# Altium schematic sheet Sheet1.SchDoc
size A4
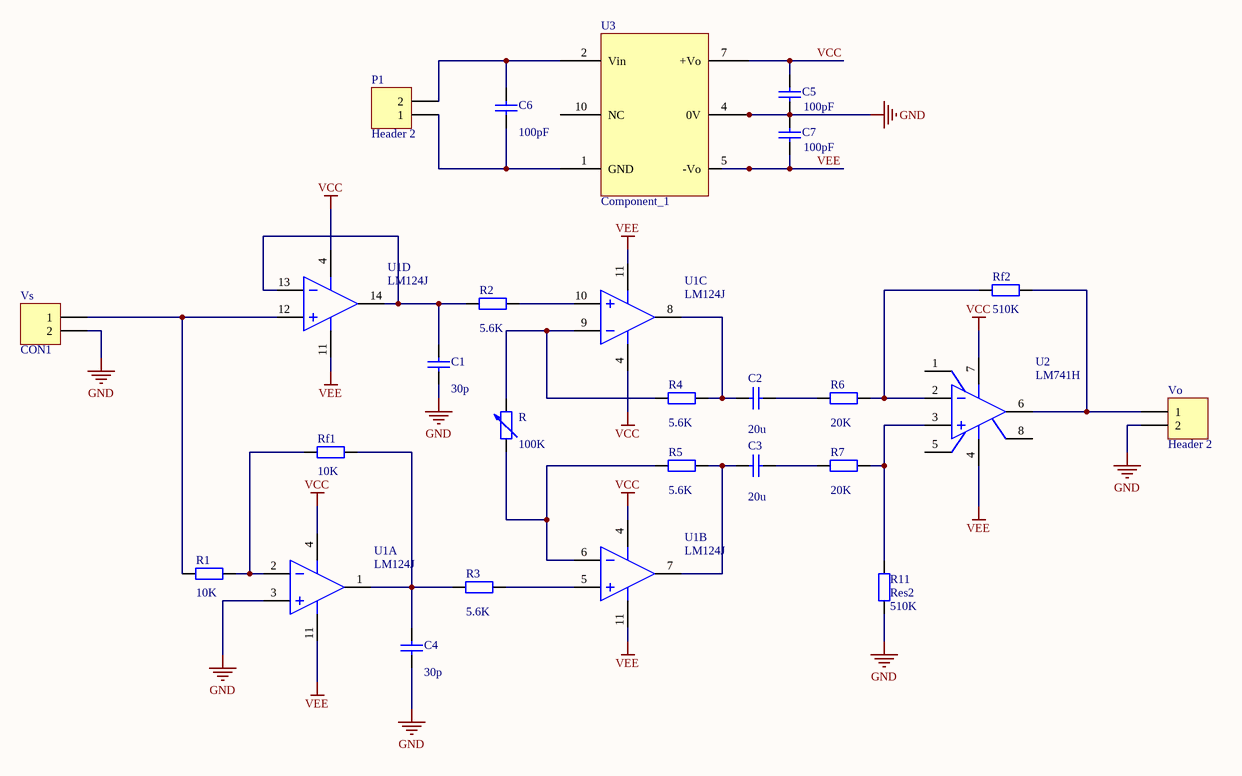
[diagram p0: Sheet1.SchDoc]

## Parts
C1  value 30p  [RAD-0.3]  (hidden comment: Cap)
C2  value 20u  [RAD-0.3]  (hidden comment: Cap)
C3  value 20u  [RAD-0.3]  (hidden comment: Cap)
C4  value 30p  [RAD-0.3]  (hidden comment: Cap)
C5  value 100pF  [RAD-0.3]  (hidden comment: Cap)
C6  value 100pF  [RAD-0.3]  (hidden comment: Cap)
C7  value 100pF  [RAD-0.3]  (hidden comment: Cap)
P1  Header 2  [HDR1X2]
R  value 100K  [AXIAL-0.6]  (hidden comment: Res Adj2)
R1  value 10K  [AXIAL-0.4]  (hidden comment: Res2)
R2  value 5.6K  [AXIAL-0.4]  (hidden comment: Res2)
R3  value 5.6K  [AXIAL-0.4]  (hidden comment: Res2)
R4  value 5.6K  [AXIAL-0.4]  (hidden comment: Res2)
R5  value 5.6K  [AXIAL-0.4]  (hidden comment: Res2)
R6  value 20K  [AXIAL-0.4]  (hidden comment: Res2)
R7  value 20K  [AXIAL-0.4]  (hidden comment: Res2)
R11  Res2  value 510K  [AXIAL-0.4]
Rf1  value 10K  [AXIAL-0.4]  (hidden comment: Res2)
Rf2  value 510K  [AXIAL-0.4]  (hidden comment: Res2)
U1  LM124J  [J14A]  (parts A,B,C,D of 4)
U2  LM741H  [H08C]
U3  Component_1  [PCBComponent_1]
Vo  Header 2  [HDR1X2]
Vs  CON1  [HDR1X2]

## Nets
GND: C1.1 C4.1 C5.1 C7.2 R11.1 U1.3(IN1+) U3.4(0V) Vo.2 Vs.2
VCC: C5.2 U1.4(V+) U2.7(V+) U3.7(+Vo)
VEE: C7.1 U1.11(GND) U2.4(V-) U3.5(-Vo)
NetC1_2: C1.2 R2.1 U1.13(IN4-) U1.14(OUT4)
NetC2_1: C2.1 R4.2 U1.8(OUT3)
NetC2_2: C2.2 R6.1
NetC3_1: C3.1 R5.2 U1.7(OUT2)
NetC3_2: C3.2 R7.1
NetC4_2: C4.2 R3.1 Rf1.2 U1.1(OUT1)
NetC6_1: C6.1 P1.1 U3.1(GND)
NetC6_2: C6.2 P1.2 U3.2(Vin)
NetR1_1: R1.1 U1.12(IN4+) Vs.1
NetR1_2: R1.2 Rf1.1 U1.2(IN1-)
NetR2_2: R2.2 U1.10(IN3+)
NetR3_2: R3.2 U1.5(IN2+)
NetR6_2: R6.2 Rf2.2 U2.2(IN-)
NetR7_2: R7.2 R11.2 U2.3(IN+)
NetR_1: R.1 R5.1 U1.6(IN2-)
NetR_2: R.2 R4.1 U1.9(IN3-)
NetRf2_1: Rf2.1 U2.6(OUT) Vo.1

Not connected (* = marked no-connect by the designer): U2 1(OFS_NULL) 5(OFS_NULL) 8(NC); U3 10(NC)

## Library data of the parts
C1-C7 = Cap: Capacitor; Published: 8-Jun-2000; LatestRevisionDate: 17-Jul-2002; LatestRevisionNote: Re-released for DXP Platform.; PackageReference: RAD-0.3; Publisher: Altium Limited; PackageDescription: Radial Cap, Thru-Hole; 2 Leads; 0.3 in Pin Spacing
P1 Vo Vs = Header 2: Header, 2-Pin; LatestRevisionDate: 17-Jul-2002; LatestRevisionNote: Re-released for DXP Platform.; Publisher: Altium Limited
R = Res Adj2: Variable Resistor; Set Position: 0.5; Published: 8-Jun-2000; LatestRevisionDate: 17-Jul-2002; LatestRevisionNote: Re-released for DXP Platform.; PackageReference: AXIAL-0.6; Publisher: Altium Limited; PackageDescription: Axial Device, Thru-Hole; 2 Leads; 0.6 in Pin Spacing
R1-R7 R11 Rf1 Rf2 = Res2: Resistor; Published: 8-Jun-2000; LatestRevisionDate: 17-Jul-2002; LatestRevisionNote: Re-released for DXP Platform.; PackageReference: AXIAL-0.4; Publisher: Altium Limited; PackageDescription: Axial Device, Thru-Hole; 2 Leads; 0.4 in Pin Spacing
U1 = LM124J: Low Power Quad Operational Amplifier, 14-pin CerDIP; Manufacturer: National Semiconductor; PackageTopMarking: NSUZXYYTT*LM124J; PowerWise: N; CompType: Amplifiers; High-Reliability: Y; Published: 4-Dec-2008; LatestRevisionDate: 13-Jan-2009; LatestRevisionNote: Sim Model Added.; DatasheetVersion: Aug-2000; PackageVersion: revJ, Jul-2002; PackageReference: J14A; Publisher: Altium Limited; PackageDescription: Cerdip, .400 x .310in Body, 14 Lead, .300in Centers, .100in Pitch; Supplier 1: Digi-Key; Supplier Part Number 1: LM124J-ND; Supplier 2: Farnell; Supplier Part Number 2: 399978; PartNumber: LM124J; RoHS: N; PinCount: 14; ComponentLink1Description: LM124 Datasheet; ComponentLink1URL: http://www.national.com/ds/LM/LM124.pdf; ComponentLink2Description: LM124 Web Page; ComponentLink2URL: http://www.national.com/pf/LM/LM124.html; ComponentLink3Description: J14A Package Page; ComponentLink3URL: http://www.national.com/packaging/folders/j14a.html
U2 = LM741H: Operational Amplifier, 8-pin TO-99; Manufacturer: National Semiconductor; PackageTopMarking: NSZXYTTE# LM741H; PowerWise: N; CompType: Amplifiers; High-Reliability: Y; Published: 4-Dec-2008; LatestRevisionDate: 13-Jan-2009; LatestRevisionNote: Sim Model Added.; DatasheetVersion: Aug-2000; PackageVersion: revF, Jun-1995; PackageReference: H08C; Publisher: Altium Limited; PackageDescription: Metal Can, TO-99, 8 Lead, .200 Dia., P.C.; Supplier 1: Farnell; Supplier Part Number 1: 1216155; PartNumber: LM741H; RoHS: N; PinCount: 8; Code_JEDEC: TO-99; ComponentLink1Description: LM741 Datasheet; ComponentLink1URL: http://www.national.com/ds/LM/LM741.pdf; ComponentLink2Description: LM741 Web Page; ComponentLink2URL: http://www.national.com/pf/LM/LM741.html; ComponentLink3Description: H08C Package Page; ComponentLink3URL: http://www.national.com/packaging/folders/h08c.html